# EAGLE design SK3000v5 NEW MOSFETS (EAGLE 7.2.0)
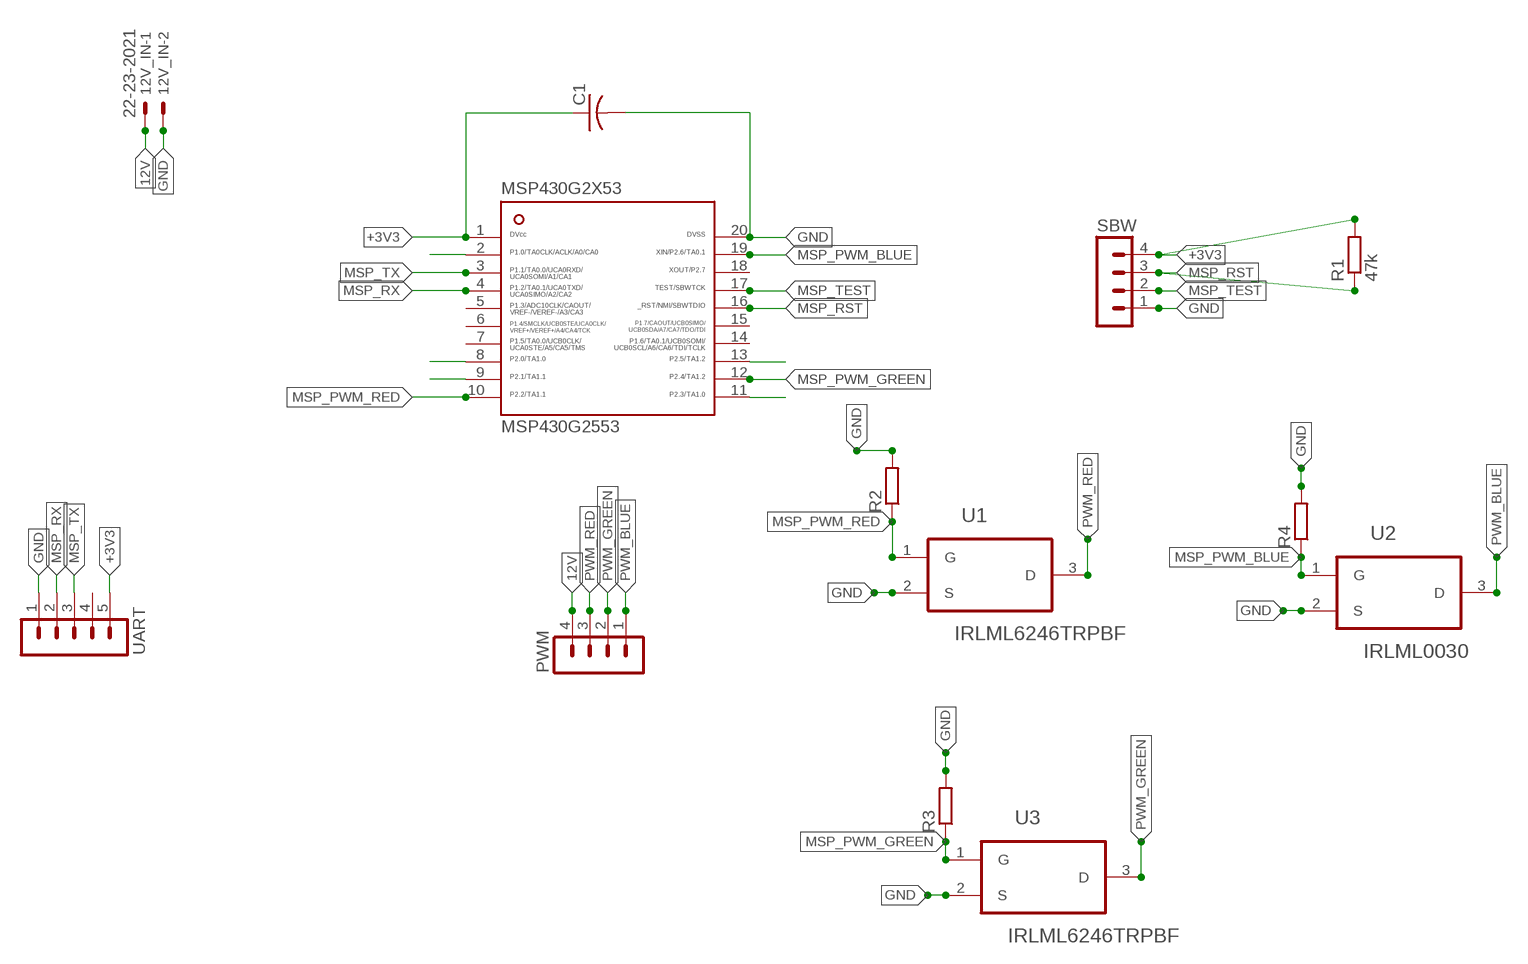
[diagram p0: schematic, sheet 1]

## Parts
12V_IN  22-23-2021  [22-23-2021]
C1  C-USC0603  [C0603]
MSP430G2553  MSP430G2X53-20PW20  [PW20]
PWM  MA04-1  [MA04-1]
R1  47k  R-EU_R0603  [R0603]
R2  R-EU_R0603  [R0603]
R3  R-EU_R0603  [R0603]
R4  R-EU_R0603  [R0603]
SBW  MA04-1  [MA04-1]
U1  IRLML6246TRPBF  [SOT95P240X112-3N]
U2  IRLML0030  IRLML6246TRPBF  [SOT95P240X112-3N]
U3  IRLML6246TRPBF  [SOT95P240X112-3N]
UART  MA05-1  [MA05-1]

## Nets
12V: 12V_IN.1 PWM.4
+3V3: C1.1 MSP430G2553.1 R1.2 SBW.4 UART.5
GND: 12V_IN.2 C1.2 MSP430G2553.20 R2.2 R3.2 R4.2 SBW.1 U1.2(S) U2.2(S) U3.2(S) UART.1
MSP_PWM_BLUE: MSP430G2553.19 R4.1 U2.1(G)
MSP_PWM_GREEN: MSP430G2553.12 R3.1 U3.1(G)
MSP_PWM_RED: MSP430G2553.10 R2.1 U1.1(G)
MSP_RST: MSP430G2553.16 R1.1 SBW.3
MSP_RX: MSP430G2553.4 UART.2
MSP_TEST: MSP430G2553.17 SBW.2
MSP_TX: MSP430G2553.3 UART.3
N$32: MSP430G2553.2
N$33: MSP430G2553.8
N$34: MSP430G2553.9
N$36: MSP430G2553.13
N$37: MSP430G2553.11
PWM_BLUE: PWM.1 U2.3(D)
PWM_GREEN: PWM.2 U3.3(D)
PWM_RED: PWM.3 U1.3(D)
Unconnected: MSP430G2553.5 MSP430G2553.6 MSP430G2553.7 MSP430G2553.14 MSP430G2553.15 MSP430G2553.18 UART.4

## Library data of the parts
12V_IN = con-molex:22-23-2021: .100" (2.54mm) Center Header - 2 Pin; MF: MOLEX; MPN: 22-23-2021; OC_FARNELL: 1462926; OC_NEWARK: 25C3832
C1 = adafruit:C-US: CAPACITOR, American symbol
MSP430G2553 = ti_msp430:MSP430G2X53-20
PWM SBW = con-lstb:MA04-1: PIN HEADER; OC_FARNELL: unknown; OC_NEWARK: unknown
R1-R4 = rcl:R-EU_: RESISTOR, European symbol
U1-U3 = International_Rectifier_By_element14_Batch_1:IRLML6246TRPBF: Power MOSFET; MPN: IRLML6246TRPBF; OC_FARNELL: 1857343; OC_NEWARK: 84R9707; PACKAGE: SOT-23-3; SUPPLIER: INTERNATIONAL RECTIFIER
UART = con-lstb:MA05-1: PIN HEADER; OC_FARNELL: unknown; OC_NEWARK: unknown

## Board
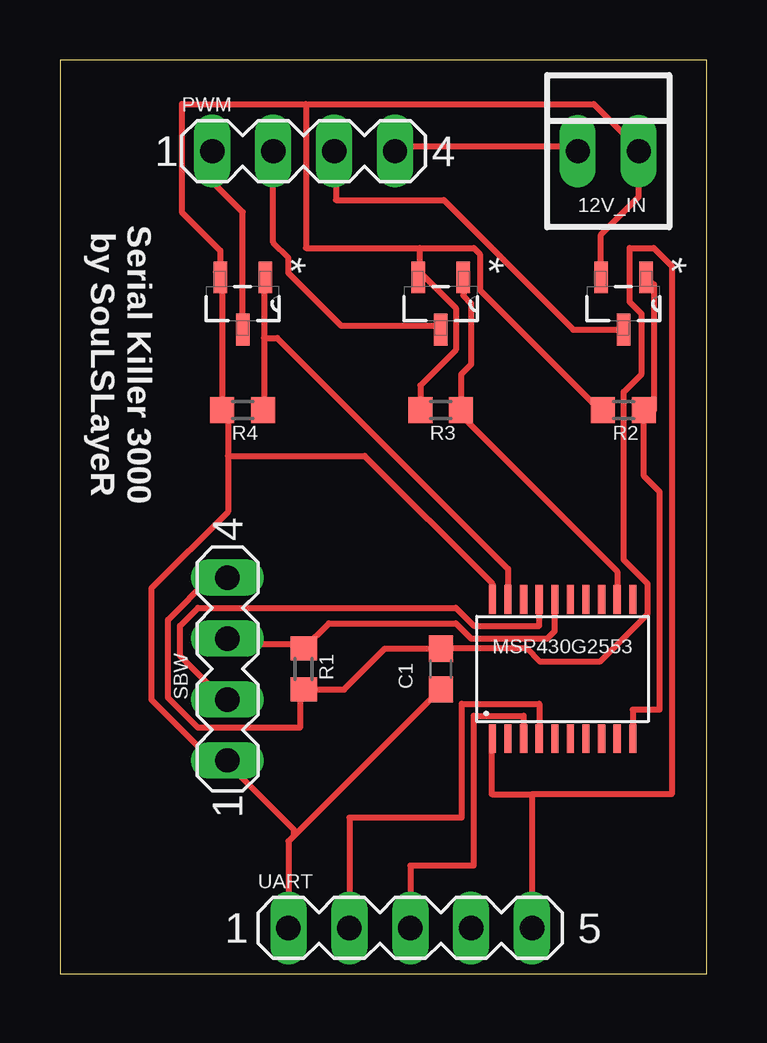
[diagram p1: board, top side]

Size 26.98 x 38.09 mm. Coordinates in mm from the lower left corner, seen from the top.
Outline: 0,0 26.98,0 26.98,38.09 0,38.09 0,0
Copper layers (1*16): Top 0.035mm / dielectric 1.5mm / Bottom 0.035mm
Design rules "default": minimum track width 10mil, minimum drill 24mil, track to track 8mil, track to pad 8mil, pad to pad 8mil, via to via 8mil, smd to smd 8mil, copper to edge 40mil, drill to drill 8mil, minimum pad ring 10mil, minimum via ring 8mil, stop-mask expansion 4mil, vias tented up to drill 0mil, thermal gap 10mil

### Footprints (pad centres in the part's own frame; a part is rotated, then mirrored left to right if it is on the bottom)
22-23-2021 = drill 1 long: 1 -1.27,0; 2 1.27,0
C0603 = smd 1.1 x 1: 1 -0.85,0; 2 0.85,0
PW20 = smd 0.3 x 1.2: 1 -2.925,-2.9; 2 -2.275,-2.9; 3 -1.625,-2.9; 4 -0.975,-2.9; 5 -0.325,-2.9; 6 0.325,-2.9; 7 0.975,-2.9; 8 1.625,-2.9; 9 2.275,-2.9; 10 2.925,-2.9; 11 2.925,2.9; 12 2.275,2.9; 13 1.625,2.9; 14 0.975,2.9; 15 0.325,2.9; 16 -0.325,2.9; 17 -0.975,2.9; 18 -1.625,2.9; 19 -2.275,2.9; 20 -2.925,2.9
MA04-1 = drill 1.016 long: 1 -3.81,0; 2 -1.27,0; 3 1.27,0; 4 3.81,0
R0603 = smd 1 x 1.1: 1 -0.85,0; 2 0.85,0
SOT95P240X112-3N = smd 1.321 x 0.559: 1 -1.092,0.94; 2 -1.092,-0.94; 3 1.092,0
MA05-1 = drill 1.016 long: 1 -5.08,0; 2 -2.54,0; 3 0,0; 4 2.54,0; 5 5.08,0

### Placement (x,y rotation side)
12V_IN  22.86,34.29 0 top
C1  15.88,12.7 270 top
MSP430G2553  20.95,12.7 0 top
PWM  10.16,34.29 0 top
R1  10.16,12.7 270 top
R2  23.5,23.5 180 top
R3  15.88,23.5 180 top
R4  7.62,23.5 180 top
SBW  6.99,12.7 90 top
U1  23.5,27.94 270 top
U2  7.62,27.94 270 top
U3  15.88,27.94 270 top
UART  14.61,1.91 0 top

### Tracks (layer width: path | path; a pad name or v marks a point on that pad's centre or on a via)
12V
  Top 0.254: 12V_IN.1 21.5,34.5 14,34.5 PWM.4
+3V3
  Top 0.254: MSP430G2553.1 18,9.75 18,7.48 19.68,7.48 | 19.68,7.48 25.5,7.48 25.5,29.5 24.75,30.25 23.75,30.25 23.75,28 24.25,27.5 24.25,25 23.5,24.25 23.5,17.25 24.5,16.25 24.5,15 22.5,13 20.02,13 19.47,13.55 C1.1 | 16,13.5 C1.1 | 19.68,7.48 UART.5 | C1.1 13.55,13.55 11.85,11.85 R1.2 10,11.75 10,10.25 5.75,10.25 4.5,11.5 4.5,14.75 6.26,16.51 SBW.4
GND
  Top 0.254: 9.75,5.75 15.75,11.75 C1.2 | 9.75,5.75 9.75,6 7,8.75 SBW.1 6.35,8.89 3.81,11.43 3.81,16.06 7,19.25 7,21.59 | 15,29.25 16.5,27.75 16.5,26 15.03,24.52 R3.2 15.25,23.5 | 15,30.25 17.25,30.25 17.5,30 17.5,28.5 22.5,23.5 R2.2 | 15,29.25 15,30.25 | 15,29.25 U3.2 | U2.2 6.75,29 6.75,23.5 R4.2 7,23.25 7,21.59 | 18,15.75 MSP430G2553.20 18.03,16.26 12.7,21.59 7,21.59 | 10.25,36.25 5.08,36.25 5.08,31.75 6.68,30.15 U2.2 | 10.25,36.25 22.25,36.25 24,34.5 12V_IN.2 24.13,32.38 22.55,30.81 U1.2 | 6.5,29.25 U2.2 | 15,30.25 10.25,30.25 10.25,36.25 | 9.75,5.75 9.53,5.53 UART.1
MSP_PWM_BLUE
  Top 0.254: 8.5,26.5 8.5,29 U2.1 | 8.5,26.5 8.5,23.5 R4.1 | 8.5,26.5 9.06,26.5 18.68,16.88 MSP430G2553.19
MSP_PWM_GREEN
  Top 0.254: 17,23.75 16.75,23.5 R3.1 | R3.1 16.75,23.25 20.95,19.05 23.23,16.77 MSP430G2553.12 | U3.1 16.82,28.27 17.14,27.94 17.14,25.4 16.73,24.98 R3.1
MSP_PWM_RED
  Top 0.254: 24.75,23.75 24.5,23.5 R2.1 | U1.1 24.5,29 24.77,28.73 24.77,23.5 R2.1 | 24.5,23.25 R2.1 | MSP430G2553.10 23.88,11 25,11 25,20.09 24.34,20.74 R2.1
MSP_RST
  Top 0.254: SBW.3 7,13.75 10,13.75 R1.1 11.21,14.61 16.51,14.61 17.14,13.97 20.32,13.97 20.63,14.28 MSP430G2553.16
MSP_RX
  Top 0.254: MSP430G2553.4 19.98,11.25 16.75,11.25 16.75,6.5 12.06,6.5 UART.2
MSP_TEST
  Top 0.254: 20,15.5 MSP430G2553.17 19.98,14.5 17.25,14.5 16.5,15.25 5.75,15.25 5,14.5 5,13.25 6.75,11.5 SBW.2
MSP_TX
  Top 0.254: MSP430G2553.3 19.33,10.75 17.25,10.75 17.25,4.5 14.61,4.5 UART.3
PWM_BLUE
  Top 0.254: U2.3 7.5,27 7.62,27.12 7.62,31.75 6.35,33.02 PWM.1
PWM_GREEN
  Top 0.254: U3.3 15.75,27 11.73,27 9.53,29.21 9.53,29.84 8.89,30.48 PWM.2
PWM_RED
  Top 0.254: PWM.3 11.5,34.25 11.5,32.25 16,32.25 21.4,26.85 U1.3

### Text on the board
tPlace: Serial Killer 3000 / by SouLSLayeR